# Altium schematic sheet 06_LEDs.SchDoc: ECE315 Analog
size A; Date: 4/25/2017; ApprovedBy: JSK; CheckedBy: JSK; Author: JSK; CompanyName: University of Wisconsin; DrawnBy: JSK; Engineer: JSK; Organization: ECE 315; Address1: College of Engineering; Address2: 1415 Engineering Drive; Address3: Madison, WI 53706; Address4: ECE 315 Fall 2017; Revision: A; SheetNumber: 2; SheetTotal: 2; AssemblyNumber: 0; MachineName: ECE315-S19; PCBNumber: 001; ApprovedDate: 1/17/2019
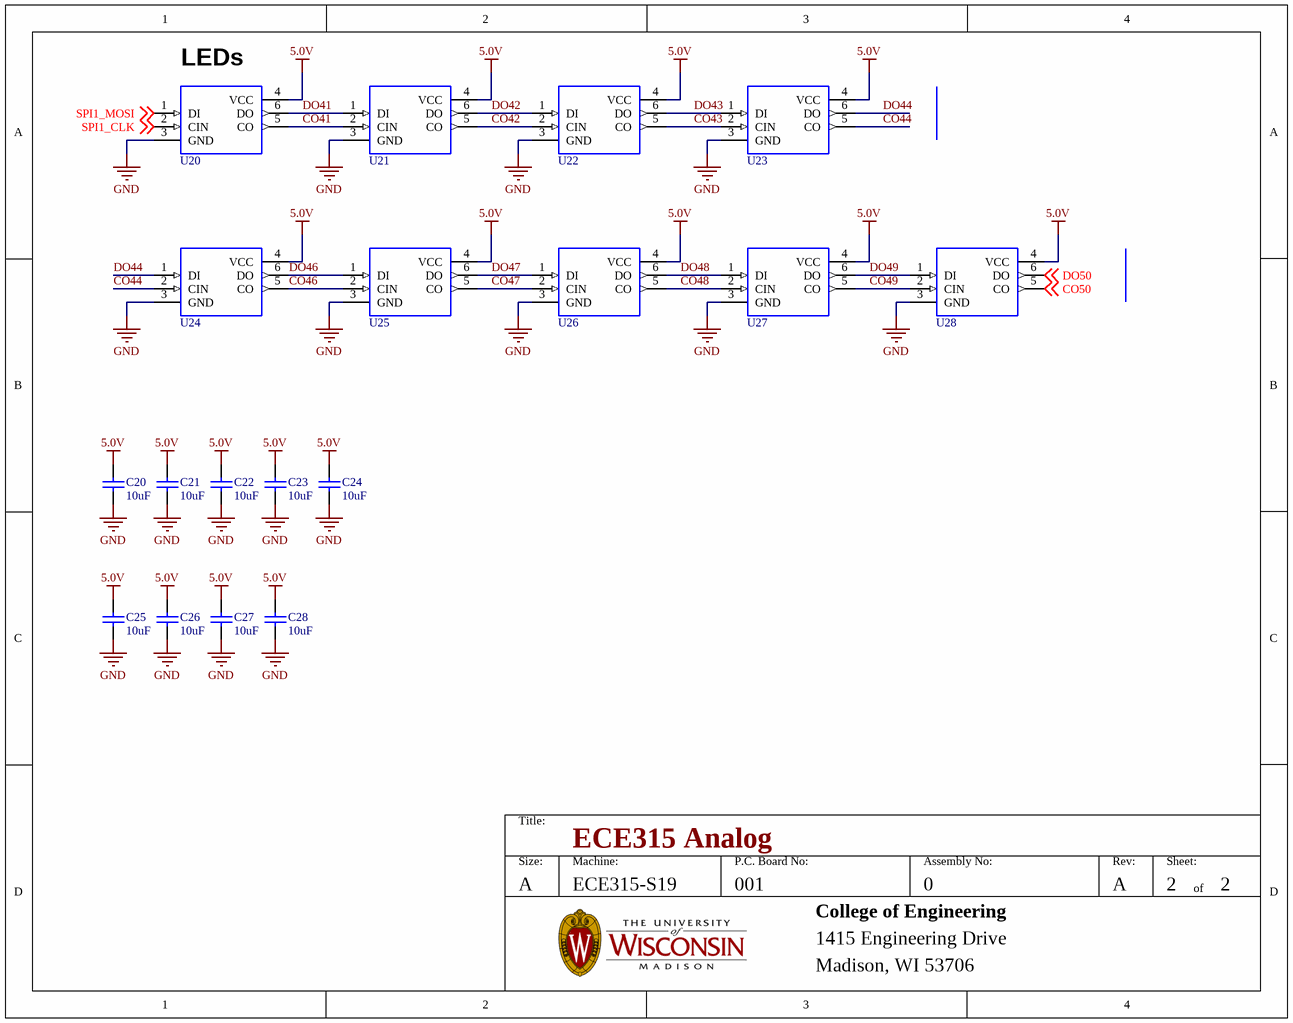
[diagram p0: 06_LEDs.SchDoc]

## Parts
C20  10uF  [CAP_0805]
C21  10uF  [CAP_0805]
C22  10uF  [CAP_0805]
C23  10uF  [CAP_0805]
C24  10uF  [CAP_0805]
C25  10uF  [CAP_0805]
C26  10uF  [CAP_0805]
C27  10uF  [CAP_0805]
C28  10uF  [CAP_0805]
U20  IC_APA102C  [APA102C]  (value not drawn)
U21  IC_APA102C  [APA102C]  (value not drawn)
U22  IC_APA102C  [APA102C]  (value not drawn)
U23  IC_APA102C  [APA102C]  (value not drawn)
U24  IC_APA102C  [APA102C]  (value not drawn)
U25  IC_APA102C  [APA102C]  (value not drawn)
U26  IC_APA102C  [APA102C]  (value not drawn)
U27  IC_APA102C  [APA102C]  (value not drawn)
U28  IC_APA102C  [APA102C]  (value not drawn)

## Nets
5.0V: C20.2 C21.2 C22.2 C23.2 C24.2 C25.2 C26.2 C27.2 C28.2 U20.4(VCC) U21.4(VCC) U22.4(VCC) U23.4(VCC) U24.4(VCC) U25.4(VCC) U26.4(VCC) U27.4(VCC) U28.4(VCC)
GND: C20.1 C21.1 C22.1 C23.1 C24.1 C25.1 C26.1 C27.1 C28.1 U20.3(GND) U21.3(GND) U22.3(GND) U23.3(GND) U24.3(GND) U25.3(GND) U26.3(GND) U27.3(GND) U28.3(GND)
CO41: U20.5(CO) U21.2(CIN)
CO42: U21.5(CO) U22.2(CIN)
CO43: U22.5(CO) U23.2(CIN)
CO44: U23.5(CO) U24.2(CIN)
CO46: U24.5(CO) U25.2(CIN)
CO47: U25.5(CO) U26.2(CIN)
CO48: U26.5(CO) U27.2(CIN)
CO49: U27.5(CO) U28.2(CIN)
CO50: U28.5(CO) ; off-sheet CO50
DO41: U20.6(DO) U21.1(DI)
DO42: U21.6(DO) U22.1(DI)
DO43: U22.6(DO) U23.1(DI)
DO44: U23.6(DO) U24.1(DI)
DO46: U24.6(DO) U25.1(DI)
DO47: U25.6(DO) U26.1(DI)
DO48: U26.6(DO) U27.1(DI)
DO49: U27.6(DO) U28.1(DI)
DO50: U28.6(DO) ; off-sheet DO50
SPI1_CLK: U20.2(CIN) ; off-sheet SPI1_CLK
SPI1_MOSI: U20.1(DI) ; off-sheet SPI1_MOSI

## Notes on the sheet
- (near U20) LEDs
- Title:
- Size:
- A
- Machine:
- P.C. Board No:
- Assembly No:
- Rev:
- Sheet:
- of
- College of Engineering
- 1415 Engineering Drive
- Madison, WI 53706

## Library data of the parts
C20-C28 = CAP_0805_U_010.00: CAP CER 10UF 16V X7R 0805; Manufacturer: Samsung; Manufacturer Part Number: CL21A106KPCLQNC; Tolerance: 10%; Voltage Rating: 10V; Dielectric: X5R; ComponentLink3URL: https://datasheet.ciiva.com/26920/getdatasheetpartid-355170-26920201.pdf; ComponentLink3Description: https://datasheet.ciiva.com/26920/getdatasheetpartid-355170-26920201.pdf; Supplier 1: Digi-Key; Stock 1: 40000; Pricing 1: 1=0.22, 10=0.148, 100=0.0749, 500=0.05122, 1000=0.04531 (USD); Mount: Surface Mount; Case/Package: 0805; Case Code (Metric): 2012; Case Code (Imperial): 0805; Contact Plating: Tin; Min Operating Temperature: -55°C; Max Operating Temperature: 85°C; Packaging: Tape and Reel; Package Quantity: 1; Length: 2mm; Height: 0.85mm; Width: 0.049inch; Thickness: 0.037inch; Depth: 1.25mm; Radiation Hardening: No; ComponentLink1URL: https://datasheet.ciiva.com/25730/cl21a106kpclqnc-25730594.pdf; ComponentLink1Description: https://datasheet.ciiva.com/25730/cl21a106kpclqnc-25730594.pdf; Supplier Part Number 1: 1276-2402-1-ND; Capacitance: 10uF
U20-U28 = IC_APA102C: APA102C LED